# EAGLE design ISL29125 Breakout (EAGLE 6.5.0)
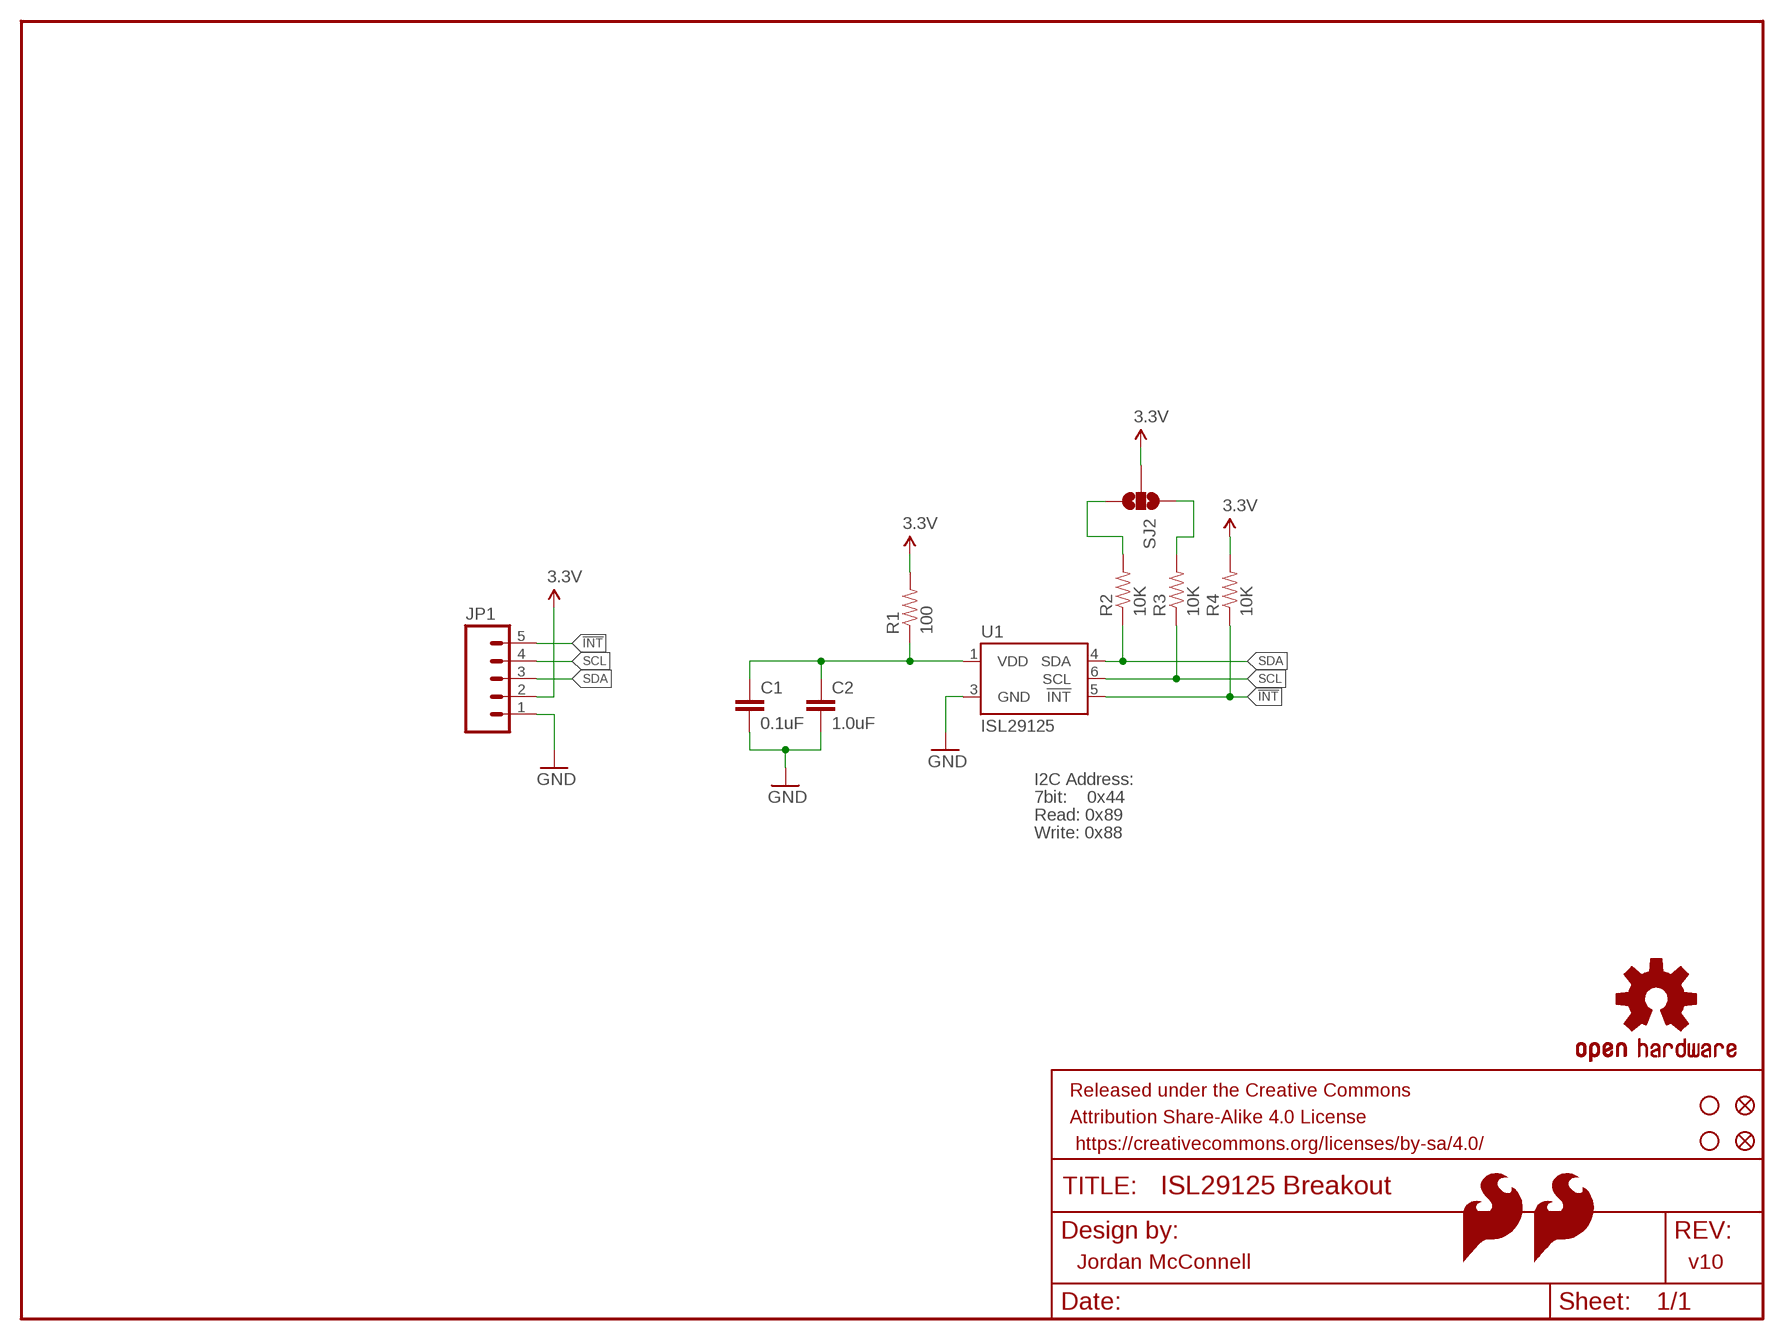
[diagram p0: schematic, sheet 1]

## Parts
C1  0.1uF  0.1UF-25V(+80/-20%)(0603)  [0603-CAP]
C2  1.0uF  1.0UF-16V-10%(0603)  [0603-CAP]
FID1  FIDUCIAL1X2  [FIDUCIAL-1X2]
FID2  FIDUCIAL1X2  [FIDUCIAL-1X2]
FRAME1  FRAME-LETTER  [CREATIVE_COMMONS]
JP1  M05PTH  [1X05]
LOGO2  SFE_LOGO_FLAME.2_INCH  [SFE_LOGO_FLAME_.2]
LOGO3  OSHW-LOGOS  [OSHW-LOGO-S]
LOGO4  SFE_LOGO_FLAME.2_INCH  [SFE_LOGO_FLAME_.2]
R1  100  100OHM1/10W1%(0603)  [0603-RES]
R2  10K  10KOHM1/10W1%(0603)0603  [0603-RES]
R3  10K  10KOHM1/10W1%(0603)0603  [0603-RES]
R4  10K  10KOHM1/10W1%(0603)0603  [0603-RES]
SJ2  SOLDERJUMPER_2WAYS  [SJ_3]
STANDOFF1  STAND-OFF  [STAND-OFF]
STANDOFF2  STAND-OFF  [STAND-OFF]
U1  ISL29125  [ODFN-LD-6]

## Nets
3.3V: JP1.2 R1.2 R4.2 SJ2.2
!INT: JP1.5 R4.1 U1.5(!INT)
GND: C1.2 C2.2 JP1.1 U1.3(GND)
N$1: C1.1 C2.1 R1.1 U1.1(VDD)
N$3: R2.2 SJ2.3
N$4: R3.2 SJ2.1
SCL: JP1.4 R3.1 U1.6(SCL)
SDA: JP1.3 R2.1 U1.4(SDA)

## Notes on the sheet
- I2C Address:
- 7bit:    0x44
- Read: 0x89
- Write: 0x88
- Jordan McConnell | v10

## Library data of the parts
C1 = SparkFun-Capacitors:0.1UF-25V(+80/-20%)(0603): CAP-00810 Ceramic Standard decoupling cap; PROD_ID: CAP-00810
C2 = SparkFun-Capacitors:1.0UF-16V-10%(0603): CAP-00868; PROD_ID: CAP-00868
FID1 FID2 = SparkFun-Aesthetics:FIDUCIAL: Fiducial Alignment Points Various fiducial points for machine vision alignment.
FRAME1 = SparkFun-Aesthetics:FRAME-LETTER: Schematic Frame Standard 8.5x11 US Letter frame
JP1 = SparkFun-Connectors:M05: Header 5 Standard 5-pin 0.1" header. Use with straight break away headers (SKU : PRT-00116), right angle break away headers (PRT-00553), swiss pins (PRT-00743), machine pins (PRT-00117), and female headers (PRT-00115). Molex polarized connector foot print use with SKU : PRT-08230 with associated crimp pins and housings.
LOGO2 LOGO4 = SparkFun-Aesthetics:SFE_LOGO_FLAME: SFE Logo, flame only This is the SparkFun flame logo. The logo on the schematic will always be the same size; the package variant is the height of the flame. Default layer for the logo on the board is tSilk.
LOGO3 = SparkFun-Aesthetics:OSHW-LOGO: Open Source Hardware Logo This logo indicates the piece of hardware it is found on incorporates a OSHW license and/or adheres to the definition of open source hardware found here: http://freedomdefined.org/OSHW
R1 = SparkFun-Resistors:100OHM1/10W1%(0603): RES-07863; PROD_ID: RES-07863
R2-R4 = SparkFun-Resistors:10KOHM1/10W1%(0603): RES-00824; PROD_ID: RES-00824
SJ2 = SparkFun-Passives:SOLDERJUMPER_2WAY: Solder Jumper 2 way solder jumper
STANDOFF1 STANDOFF2 = SparkFun-Electromechanical:STAND-OFF: #4 Stand Off This is the mechanical footprint for a #4 phillips button head screw. Use the keepout ring to avoid running the screw head into surrounding components. SKU : PRT-00447
U1 = SparkFun-Sensors:ISL29125: The ISL29125 is a low power, high sensitivity RGB color light sensor with an I2C interface.

## Board
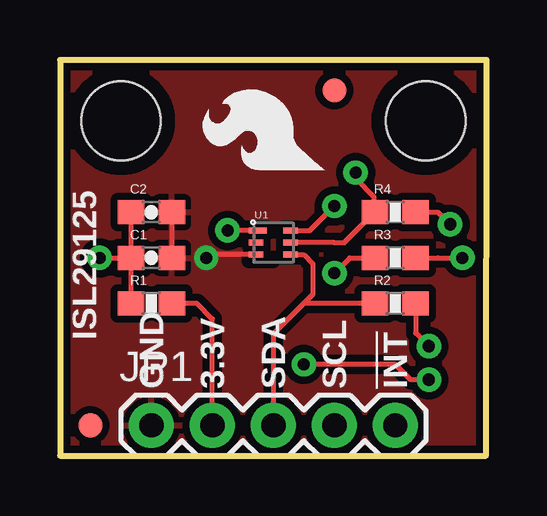
[diagram p1: board, top side]
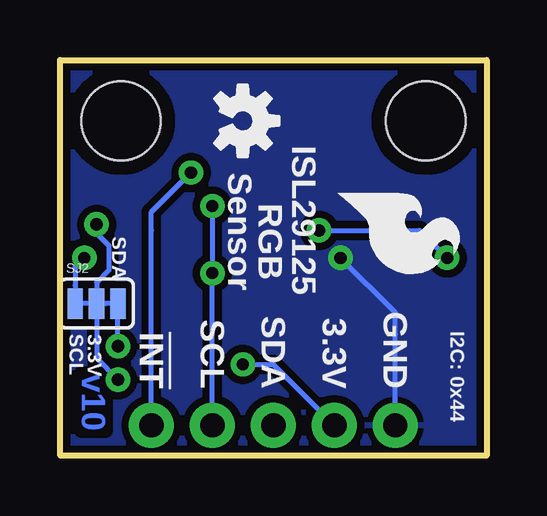
[diagram p2: board, bottom side, seen from below]

Size 17.78 x 16.51 mm. Coordinates in mm from the lower left corner, seen from the top.
Outline: 0,0 17.76,0 17.78,16.51 0,16.51 0,0
Copper layers (1*16): Top 0.035mm / dielectric 1.5mm / Bottom 0.035mm
Design rules "SparkFun": minimum track width 8mil, minimum drill 20mil, track to track 8mil, track to pad 8mil, pad to pad 8mil, via to via 8mil, smd to smd 8mil, copper to edge 8mil, drill to drill 8mil, minimum pad ring 12mil, minimum via ring 10mil, stop-mask expansion 4mil, vias tented up to drill 20mil, thermal gap 10mil
tRestrict: area 7.9,8.1 to 8.9,8.3

### Footprints (pad centres in the part's own frame; a part is rotated, then mirrored left to right if it is on the bottom)
0603-CAP = smd 1.1 x 1: 1 -0.85,0; 2 0.85,0
FIDUCIAL-1X2 = smd 1 x 1: 1 0,0
1X05 = drill 1.016 pad 1.88: 1 0,0; 2 2.54,0; 3 5.08,0; 4 7.62,0; 5 10.16,0
0603-RES = smd 1.1 x 1: 1 -0.85,0; 2 0.85,0
SJ_3 = smd 0.635 x 1.27: 1 -0.889,0; 2 0,0; 3 0.889,0
STAND-OFF = hole 3.302: 0,0
ODFN-LD-6 = smd 0.75 x 0.25: 1 -0.645,0.5 | smd 0.6 x 0.25: 2 -0.72,0; 3 -0.72,-0.5; 4 0.72,-0.5; 5 0.72,0; 6 0.72,0.5

### Placement (x,y rotation side)
C1  3.81,8.26 0 top
C2  3.81,10.16 0 top
FID1  11.43,15.24 0 top
FID2  1.27,1.27 0 top
FRAME1  -7.62,-19.05 0 top  (outside the outline)
JP1  3.81,1.27 0 top
LOGO2  6.48,11.3 270 bottom
LOGO3  10.16,13.97 270 bottom
LOGO4  11.3,11.56 90 top
R1  3.81,6.35 0 top
R2  13.97,6.35 0 top
R3  13.97,8.26 0 top
R4  13.97,10.16 0 top
SJ2  16.26,6.35 0 bottom
STANDOFF1  2.54,13.97 0 top
STANDOFF2  15.24,13.97 0 top
U1  8.89,8.89 0 top

### Tracks (layer width: path | path; a pad name or v marks a point on that pad's centre or on a via)
3.3V  (via drill 0.51)
  Top 0.203: JP1.2 6.35,4.45 6.35,5.71 5.71,6.35 R1.2 | R4.2 15.75,10.16 v16.26,9.65 | v15.37,3.17 14.61,3.17 13.97,3.81 v10.16,3.81
  Bottom 0.203: SJ2.2 16.26,4.06 v15.37,3.17 | v10.16,3.81 8.89,3.81 JP1.2 | SJ2.2 17.27,6.35 | 15.24,6.35 15.88,6.35 SJ2.2 | v16.26,9.65 16.26,9.27 15.75,8.76 15.75,7.75 16.26,7.24 SJ2.2
!INT  (via drill 0.51)
  Top 0.203: R4.1 12.7,10.16 | U1.5 11.43,8.89 11.85,8.89 R4.1 | 13.08,10.2 R4.1 | 13.08,10.2 13.08,10.79 12.32,11.56 v12.32,11.81 | 13.08,10.2 R4.1
  Bottom 0.203: JP1.5 13.97,9.4 13.97,10.16 12.7,11.43 v12.32,11.81
GND  (via drill 0.51)
  Top 0.203: U1.3 6.36,8.39 6.23,8.39 v6.1,8.26 | C2.2 C1.2
  Bottom 0.203: JP1.1 3.81,5.08 3.81,5.97 v6.1,8.26
  pour Top (isolate 0.305): 0,16.51 17.78,16.51 17.78,0 0,0
  pour Bottom (isolate 0.305): 0,0 0,16.51 17.78,16.51 17.78,0
N$1  (via drill 0.51)
  Top 0.203: U1.1 v6.99,9.39 v6.99,9.4 | C1.1 C2.1 | R1.1 C1.1 | v1.65,8.26 C1.1
  Bottom 0.203: 2.79,9.39 2.41,9.02 | 2.41,9.02 v1.65,8.26 | v6.99,9.4 2.79,9.4 2.41,9.02
N$3  (via drill 0.51)
  Top 0.203: R2.2 14.82,5.12 v15.37,4.57
  Bottom 0.203: v15.37,4.57 SJ2.3
N$4  (via drill 0.51)
  Top 0.203: R3.2 15.75,8.26 v16.76,8.26
  Bottom 0.203: SJ2.1 17.14,7.11 17.14,7.87 v16.76,8.26
SCL  (via drill 0.51)
  Top 0.203: v11.43,7.62 12.06,8.26 R3.1 | U1.6 10.41,9.39 v11.43,10.41
  Bottom 0.203: JP1.4 v11.43,7.62 v11.43,10.41
SDA
  Top 0.203: R2.1 10.16,6.35 | 10.16,6.35 8.89,5.08 JP1.3 | U1.4 10.15,8.39 10.54,8 10.54,6.73 10.16,6.35

### Text on the board
Bottom: v10
tPlace: ISL29125 | GND | 3.3V | SDA | SCL | !INT
bPlace: ISL29125 | Sensor | RGB | SDA | I2C: 0x44 | 3.3V | SCL | GND | 3.3V | SDA | SCL | !INT
tNames: Jordan McConnell